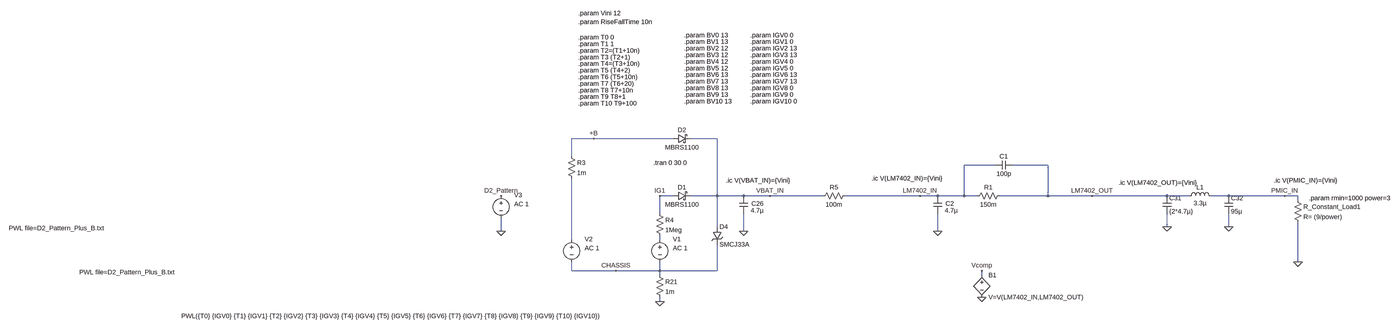
[diagram p0: schematic LM74202_Ideal_Diode_Circuit.asc, whole sheet]
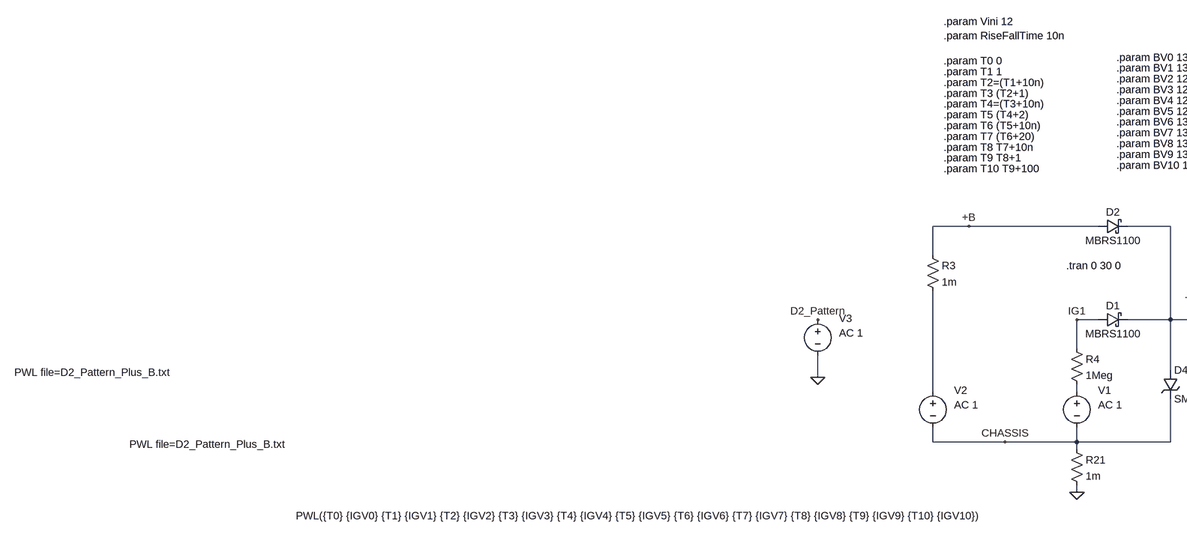
[diagram p1: schematic LM74202_Ideal_Diode_Circuit.asc, part, row 1 of 1, column 1 of 2]
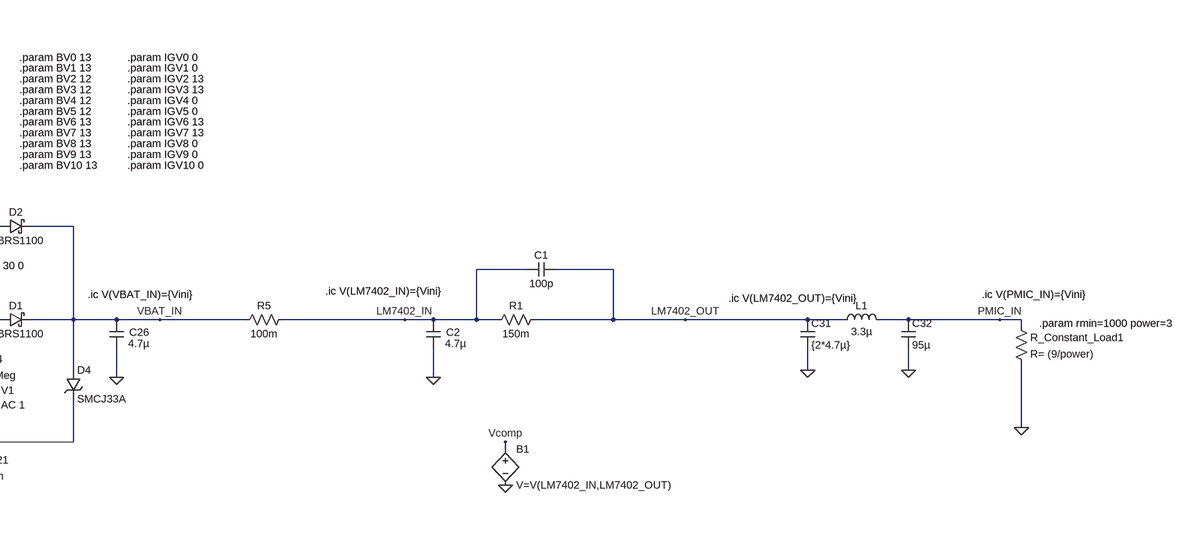
[diagram p2: schematic LM74202_Ideal_Diode_Circuit.asc, part, row 1 of 1, column 2 of 2]
LM74202_Ideal_Diode_Circuit.asc, the LTspice schematic file:
Version 4
SHEET 1 6608 8804
WIRE -1600 6832 -1680 6832
WIRE -1312 6832 -1600 6832
WIRE -1152 6832 -1248 6832
WIRE -1680 6896 -1680 6832
WIRE -144 6928 -256 6928
WIRE 48 6928 -80 6928
WIRE -1312 7040 -1360 7040
WIRE -1152 7040 -1152 6832
WIRE -1152 7040 -1248 7040
WIRE -1056 7040 -1152 7040
WIRE -960 7040 -1056 7040
WIRE -768 7040 -960 7040
WIRE -416 7040 -688 7040
WIRE -352 7040 -416 7040
WIRE -256 7040 -256 6928
WIRE -256 7040 -352 7040
WIRE -208 7040 -256 7040
WIRE 48 7040 48 6928
WIRE 48 7040 -128 7040
WIRE 208 7040 48 7040
WIRE 480 7040 208 7040
WIRE 560 7040 480 7040
WIRE 704 7040 640 7040
WIRE 1152 7040 704 7040
WIRE 1200 7040 1152 7040
WIRE 1200 7056 1200 7040
WIRE -1360 7104 -1360 7040
WIRE -1152 7152 -1152 7040
WIRE 480 7152 480 7104
WIRE 704 7152 704 7104
WIRE -1936 7168 -1936 7120
WIRE -1056 7168 -1056 7104
WIRE -352 7168 -352 7104
WIRE -1680 7200 -1680 6976
WIRE -1360 7200 -1360 7184
WIRE 1200 7280 1200 7136
WIRE -1680 7312 -1680 7280
WIRE -1520 7312 -1680 7312
WIRE -1360 7312 -1360 7280
WIRE -1360 7312 -1520 7312
WIRE -1152 7312 -1152 7216
WIRE -1152 7312 -1360 7312
WIRE -1360 7328 -1360 7312
WIRE -192 7328 -192 7312
WIRE -1360 7424 -1360 7408
FLAG -1056 7168 0
FLAG 480 7152 0
FLAG 704 7152 0
FLAG -416 7040 LM7402_IN
FLAG 208 7040 LM7402_OUT
FLAG 1152 7040 PMIC_IN
FLAG -1360 7424 0
FLAG -1520 7312 CHASSIS
FLAG -1600 6832 +B
FLAG -1360 7040 IG1
FLAG -352 7168 0
FLAG -960 7040 VBAT_IN
FLAG 1200 7280 0
FLAG -192 7408 0
FLAG -192 7312 Vcomp
FLAG -1936 7168 0
FLAG -1936 7040 D2_Pattern
SYMBOL cap -1072 7040 R0
WINDOW 0 44 28 Left 2
WINDOW 3 42 53 Left 2
SYMATTR InstName C26
SYMATTR Value 4.7µ
SYMBOL cap 464 7040 R0
SYMATTR InstName C31
SYMATTR Value {2*4.7µ}
SYMBOL ind 544 7056 R270
WINDOW 0 32 56 VTop 2
WINDOW 3 5 56 VBottom 2
SYMATTR InstName L1
SYMATTR Value 3.3µ
SYMBOL cap 688 7040 R0
SYMATTR InstName C32
SYMATTR Value 95µ
SYMBOL res -1376 7312 R0
SYMATTR InstName R21
SYMATTR Value 1m
SYMBOL res -112 7024 R90
WINDOW 0 0 56 VBottom 2
WINDOW 3 32 56 VTop 2
SYMATTR InstName R1
SYMATTR Value 150m
SYMBOL cap -80 6912 R90
WINDOW 0 0 32 VBottom 2
WINDOW 3 32 32 VTop 2
SYMATTR InstName C1
SYMATTR Value 100p
SYMBOL schottky -1312 6848 R270
WINDOW 0 32 32 VTop 2
WINDOW 3 0 32 VBottom 2
SYMATTR InstName D2
SYMATTR Value MBRS1100
SYMATTR Description Diode
SYMATTR Type diode
SYMBOL schottky -1312 7056 R270
WINDOW 0 32 32 VTop 2
WINDOW 3 0 32 VBottom 2
SYMATTR InstName D1
SYMATTR Value MBRS1100
SYMATTR Description Diode
SYMATTR Type diode
SYMBOL res -1696 6880 R0
SYMATTR InstName R3
SYMATTR Value 1m
SYMBOL res -1376 7088 R0
SYMATTR InstName R4
SYMATTR Value 1Meg
SYMBOL voltage -1360 7184 R0
WINDOW 123 47 46 Left 2
WINDOW 39 0 0 Left 0
WINDOW 3 -1736 292 Left 2
WINDOW 0 47 13 Left 2
SYMATTR Value2 AC 1
SYMATTR Value PWL({T0} {IGV0} {T1} {IGV1} {T2} {IGV2} {T3} {IGV3} {T4} {IGV4} {T5} {IGV5} {T6} {IGV6} {T7} {IGV7} {T8} {IGV8} {T9} {IGV9} {T10} {IGV10})
SYMATTR InstName V1
SYMBOL cap -368 7040 R0
WINDOW 0 44 28 Left 2
WINDOW 3 42 53 Left 2
SYMATTR InstName C2
SYMATTR Value 4.7µ
SYMBOL res -672 7024 R90
WINDOW 0 0 56 VBottom 2
WINDOW 3 32 56 VTop 2
SYMATTR InstName R5
SYMATTR Value 100m
SYMBOL res 1184 7040 R0
SYMATTR InstName R_Constant_Load1
SYMATTR Value R= (9/power)
SYMBOL bv -192 7312 R0
SYMATTR InstName B1
SYMATTR Value V=V(LM7402_IN,LM7402_OUT)
SYMBOL TVSdiode -1168 7152 R0
SYMATTR InstName D4
SYMATTR Value SMCJ33A
SYMBOL voltage -1936 7024 R0
WINDOW 123 47 46 Left 2
WINDOW 39 0 0 Left 0
WINDOW 3 -1786 133 Left 2
WINDOW 0 47 13 Left 2
SYMATTR Value2 AC 1
SYMATTR Value PWL file=D2_Pattern_Plus_B.txt
SYMATTR InstName V3
SYMBOL voltage -1680 7184 R0
WINDOW 123 47 46 Left 2
WINDOW 39 0 0 Left 0
WINDOW 3 -1786 133 Left 2
WINDOW 0 47 13 Left 2
SYMATTR Value2 AC 1
SYMATTR Value PWL file=D2_Pattern_Plus_B.txt
SYMATTR InstName V2
TEXT -1384 6920 Left 2 !.tran 0 30 0
TEXT -1656 6488 Left 2 !.param T1 1
TEXT -1656 6512 Left 2 !.param T2=(T1+10n)
TEXT -1656 6536 Left 2 !.param T3 (T2+1)
TEXT -1656 6560 Left 2 !.param T4=(T3+10n)
TEXT -1656 6584 Left 2 !.param T5 (T4+2)
TEXT -1656 6608 Left 2 !.param T6 (T5+10n)
TEXT -1656 6632 Left 2 !.param T7 (T6+20)
TEXT -1656 6656 Left 2 !.param T8 T7+10n
TEXT -1656 6680 Left 2 !.param T9 T8+1
TEXT -1656 6704 Left 2 !.param T10 T9+100
TEXT -1272 6480 Left 2 !.param BV1 13
TEXT -1272 6504 Left 2 !.param BV2 12
TEXT -1272 6528 Left 2 !.param BV3 12
TEXT -1272 6552 Left 2 !.param BV4 12
TEXT -1272 6576 Left 2 !.param BV5 12
TEXT -1272 6600 Left 2 !.param BV6 13
TEXT -1272 6624 Left 2 !.param BV7 13
TEXT -1272 6648 Left 2 !.param BV8 13
TEXT -1272 6672 Left 2 !.param BV9 13
TEXT -1272 6696 Left 2 !.param BV10 13
TEXT -1656 6464 Left 2 !.param T0 0
TEXT -1272 6456 Left 2 !.param BV0 13
TEXT -1656 6408 Left 2 !.param RiseFallTime 10n
TEXT -1032 6480 Left 2 !.param IGV1 0
TEXT -1032 6504 Left 2 !.param IGV2 13
TEXT -1032 6528 Left 2 !.param IGV3 13
TEXT -1032 6552 Left 2 !.param IGV4 0
TEXT -1032 6576 Left 2 !.param IGV5 0
TEXT -1032 6600 Left 2 !.param IGV6 13
TEXT -1032 6624 Left 2 !.param IGV7 13
TEXT -1032 6648 Left 2 !.param IGV8 0
TEXT -1032 6672 Left 2 !.param IGV9 0
TEXT -1032 6696 Left 2 !.param IGV10 0
TEXT -1032 6456 Left 2 !.param IGV0 0
TEXT 1112 6984 Left 2 !.ic V(PMIC_IN)={Vini}
TEXT 1240 7048 Left 2 !.param rmin=1000 power=3
TEXT -1656 6376 Left 2 !.param Vini 12
TEXT 304 6992 Left 2 !.ic V(LM7402_OUT)={Vini}
TEXT -592 6976 Left 2 !.ic V(LM7402_IN)={Vini}
TEXT -1120 6984 Left 2 !.ic V(VBAT_IN)={Vini}

The netlist it stands for:
* LM74202_Ideal_Diode_Circuit.asc
C26 VBAT_IN 0 4.7µ
C31 LM7402_OUT 0 {2*4.7µ}
L1 LM7402_OUT PMIC_IN 3.3µ
C32 PMIC_IN 0 95µ
R21 CHASSIS 0 1m
R1 LM7402_OUT LM7402_IN 150m
C1 LM7402_OUT LM7402_IN 100p
D2 +B VBAT_IN MBRS1100
D1 IG1 VBAT_IN MBRS1100
R3 +B N001 1m
R4 IG1 N002 1Meg
V1 N002 CHASSIS PWL({T0} {IGV0} {T1} {IGV1} {T2} {IGV2} {T3} {IGV3} {T4} {IGV4} {T5} {IGV5} {T6} {IGV6} {T7} {IGV7} {T8} {IGV8} {T9} {IGV9} {T10} {IGV10}) AC 1
C2 LM7402_IN 0 4.7µ
R5 LM7402_IN VBAT_IN 100m
R_Constant_Load1 PMIC_IN 0 R= (9/power)
B1 Vcomp 0 V=V(LM7402_IN,LM7402_OUT)
D4 VBAT_IN CHASSIS SMCJ33A
V3 D2_Pattern 0 PWL file=D2_Pattern_Plus_B.txt AC 1
V2 N001 CHASSIS PWL file=D2_Pattern_Plus_B.txt AC 1
.model D D
.lib standard.dio
.tran 0 30 0
.param T1 1
.param T2=(T1+10n)
.param T3 (T2+1)
.param T4=(T3+10n)
.param T5 (T4+2)
.param T6 (T5+10n)
.param T7 (T6+20)
.param T8 T7+10n
.param T9 T8+1
.param T10 T9+100
.param BV1 13
.param BV2 12
.param BV3 12
.param BV4 12
.param BV5 12
.param BV6 13
.param BV7 13
.param BV8 13
.param BV9 13
.param BV10 13
.param T0 0
.param BV0 13
.param RiseFallTime 10n
.param IGV1 0
.param IGV2 13
.param IGV3 13
.param IGV4 0
.param IGV5 0
.param IGV6 13
.param IGV7 13
.param IGV8 0
.param IGV9 0
.param IGV10 0
.param IGV0 0
.ic V(PMIC_IN)={Vini}
.param rmin=1000 power=3
.param Vini 12
.ic V(LM7402_OUT)={Vini}
.ic V(LM7402_IN)={Vini}
.ic V(VBAT_IN)={Vini}
.backanno
.end